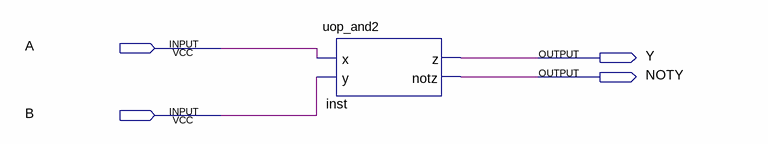
[diagram p0: schematic sheet]
// Quartus schematic comb_logic.bdf as structural Verilog: 1 symbols, 4 pins
module comb_logic (
  input  A,
  input  B,
  output Y,
  output NOTY
);

  uop_and2 inst (.x(A), .y(B), .z(Y), .notz(NOTY));
endmodule
